# EasyEDA schematic SCH_璃奈的小板板_2021-11-10.json
TITLE: Sheet_1; REV: 1.0; Date: 2020-11-30; Sheet: 1/1; Drawn By: ZhaTi; Company: 黑联科技
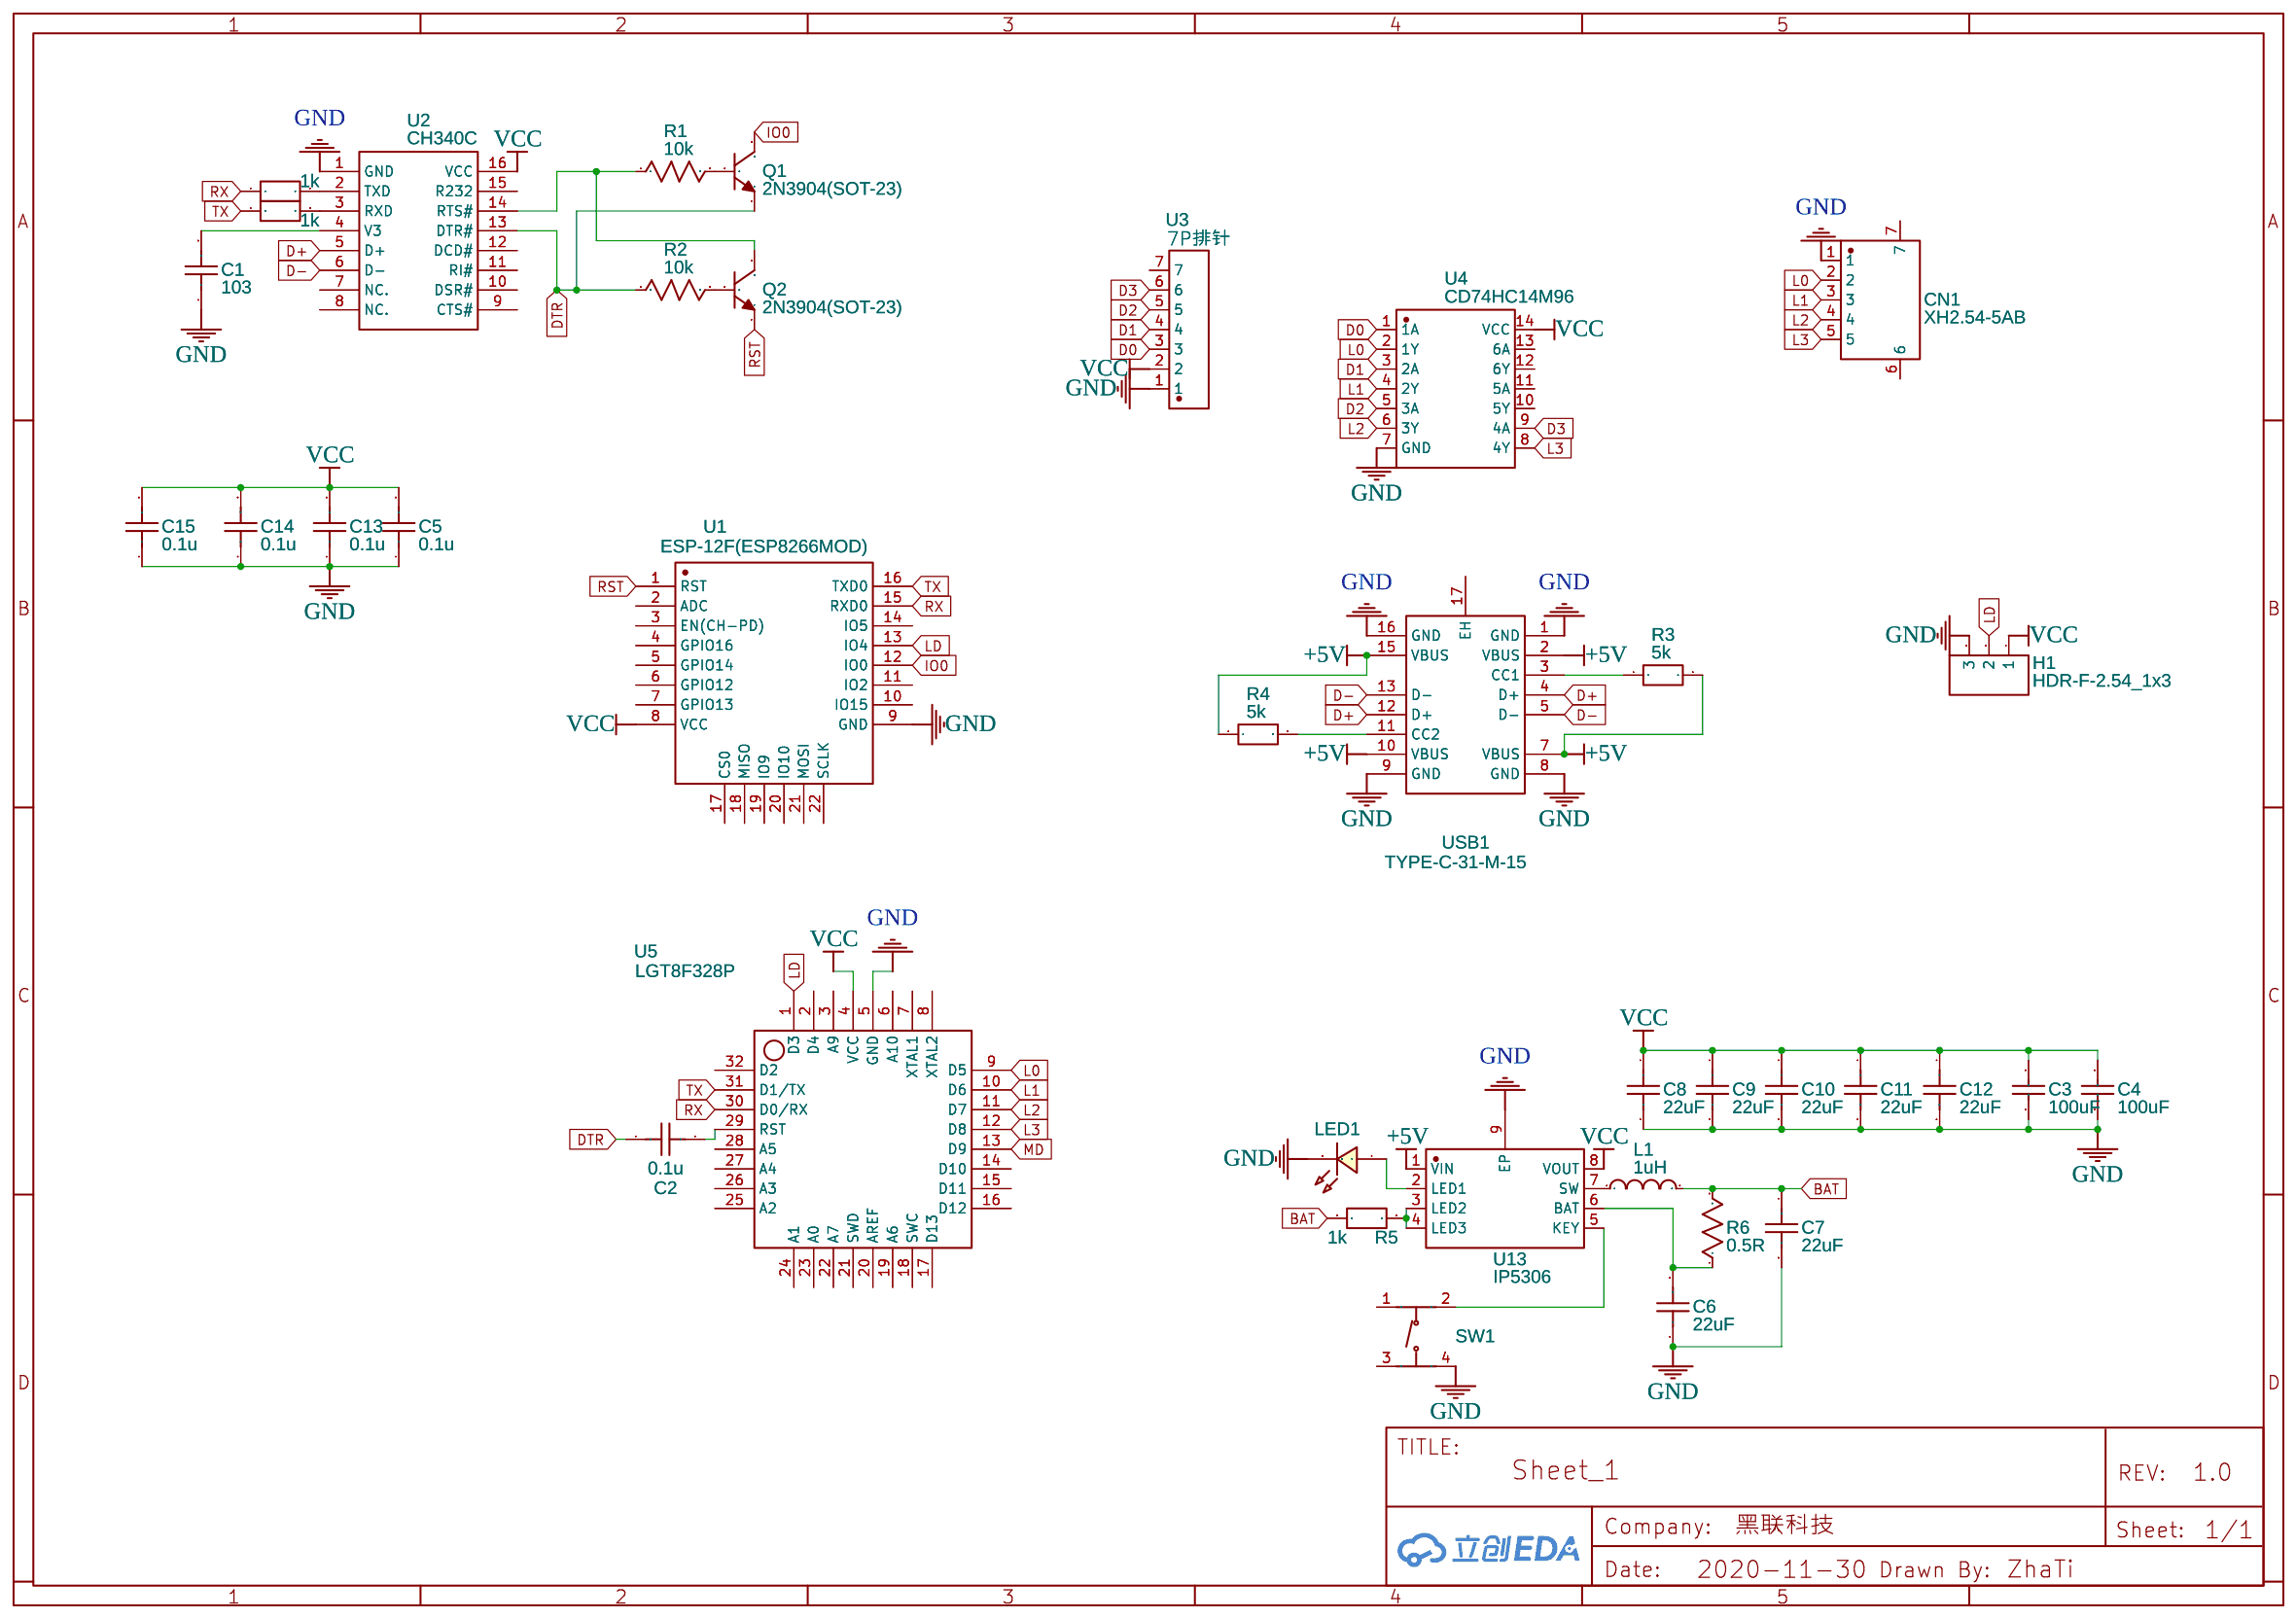
[diagram p0: schematic sheet]

## Parts
C1  103  [C0603]
C2  0.1u  [C0603]
C3  100uF  [C1210]
C4  100uF  [C1210]
C5  0.1u  [C0603]
C6  22uF  [C0805]
C7  22uF  [C0805]
C8  22uF  [C0805]
C9  22uF  [C0805]
C10  22uF  [C0805]
C11  22uF  [C0805]
C12  22uF  [C0805]
C13  0.1u  [C0603]
C14  0.1u  [C0603]
C15  0.1u  [C0603]
CN1  XH2.54-5AB  [CONN-SMD_5P-P2.54_XH2.54-5AB]
H1  HDR-F-2.54_1x3  [HDR-F-2.54_1X3]
L1  1uH  [IND-SMD_L7.1-W6.5-P5.60]
LED1  LED-0603_R  [LED0603_RED]
Q1  2N3904(SOT-23)  [SOT-23-3_L2.9-W1.3-P1.90-LS2.4-TR]
Q2  2N3904(SOT-23)  [SOT-23-3_L2.9-W1.3-P1.90-LS2.4-TR]
R1  10k  [R0603]
R2  10k  [R0603]
R3  5k  [R0603]
R4  5k  [R0603]
R5  1k  [R0603]
R6  0.5R  [R0603]
R7  1k  [R0603]
R8  1k  [R0603]
SW1  TS-1187A-B-A-B  [SW-SMD_4P-L5.1-W5.1-P3.70-LS6.5-TL-2]
U1  ESP-12F(ESP8266MOD)  [WIFIM-SMD_ESP-12F-ESP8266MOD]
U2  CH340C  [SOP-16_L10.0-W3.9-P1.27-LS6.0-BL]
U3  7P排针  [7P]
U4  CD74HC14M96  [SOIC-14_L8.7-W3.9-P1.27-LS6.0-BL]
U5  LGT8F328P  [QFP-32_L7.0-W7.0-P0.80-LS9.0-BL]
U13  IP5306  [ESOP-8_L4.9-W3.9-P1.27-LS6.0-BL-EP]
USB1  TYPE-C-31-M-15  [USBC-TH_TYPE-C-31-M-15]

## Library data of the parts
C1 C2 C5 C13-C15 = C_0603_US: Contributor: LCEDA_Lib
C3 C4 = 1210B472K251NT: Supplier: LCSC; Manufacturer: FH; Supplier Part: C52019
C6-C12 = CL21A226MQQNNNE: Supplier: LCSC; Manufacturer: SAMSUNG; Supplier Part: C5674
CN1 = XH2.54-5AB: Supplier: LCSC; Supplier Part: C146128; Manufacturer: Boom Precision Elec; Contributor: LCSC; JLCPCB Part Class: Extended Part
H1 = HDR-F-2.54_1x3: Supplier Part: C146690; Supplier: LCSC; Contributor: LCEDA_Lib
L1 = SPM6530T-1R0M120: Supplier: LCSC; Manufacturer: TDK; Supplier Part: C87572
LED1 = LED-0603_R: Manufacturer: EVERLIGHT(台湾亿光); Manufacturer Part: 19-217/R6C-AL1M2VY/3T; Supplier Part: C72044; Supplier: LCSC; Contributor: LCEDA_01
Q1 Q2 = 2N3904(SOT-23): Supplier: LCSC; Manufacturer: KEC; Manufacturer Part: 2n3904S-RTK/PS; Supplier Part: C18536; SMT Type: SOT-23; Contributor: LCEDA_Lib
R1 R2 R6 = R_0603_US: Contributor: LCEDA_Lib
R3-R5 R7 R8 = R_0603_EU: Contributor: LCEDA_Lib
SW1 = TS-1187A-B-A-B: Supplier: LCSC; Supplier Part: C318884; Manufacturer: XKB Enterprise; Contributor: LCSC; JLCPCB Part Class: Extended Part
U1 = ESP-12F(ESP8266MOD): Supplier: LCSC; Manufacturer: Ai-Thinker; Supplier Part: C82891
U2 = CH340C: Supplier: LCSC; Manufacturer: WCH; Supplier Part: C84681; LCSC Assembly: Yes; SMT Type: Extend
U3 = 7P: Contributor: ZJMAD
U4 = CD74HC14M96: Supplier: LCSC; Supplier Part: C74640; Manufacturer: Texas Instruments; Contributor: LCSC; JLCPCB Part Class: Extended Part
U5 = LGT8F328P: Contributor: ZhaTi
U13 = IP5306: Supplier: LCSC; Supplier Part: C181692; Manufacturer: INJOINIC; Contributor: LCSC; LCSC Assembly: Yes; SMT Type: Extend
USB1 = TYPE-C-31-M-15: Supplier: LCSC; Supplier Part: C223908; Manufacturer: Korean Hroparts Elec; Contributor: LCSC; JLCPCB Part Class: Extended Part

## Nets
+5V: R3.2 R4.1 U13.1(VIN) USB1.2(VBUS) USB1.7(VBUS) USB1.10(VBUS) USB1.15(VBUS)
GND: C1.1 C3.1 C4.1 C5.1 C6.1 C7.2 C8.2 C9.2 C10.2 C11.2 C12.2 C13.1 C14.1 C15.1 CN1.1 H1.3 LED1.2 SW1.4(D) U1.9(GND) U2.1(GND) U3.1 U4.7(GND) U5.5(GND) U13.9(EP) USB1.1(GND) USB1.8(GND) USB1.9(GND) USB1.16(GND)
VCC: C3.2 C4.2 C5.2 C8.1 C9.1 C10.1 C11.1 C12.1 C13.2 C14.2 C15.2 H1.1 U1.8(VCC) U2.16(VCC) U3.2 U4.14(VCC) U5.4(VCC) U13.8(VOUT)
BAT: C7.1 L1.2 R5.1 R6.2
D0: U3.3 U4.1(1A)
D1: U3.4 U4.3(2A)
D2: U3.5 U4.5(3A)
D3: U3.6 U4.9(4A)
D+: U2.5(D+) USB1.4(D+) USB1.12(D+)
D-: U2.6(D-) USB1.5(D-) USB1.13(D-)
DTR: C2.1 Q1.1(E) R2.1 U2.13(DTR#)
IO0: Q1.3(C) U1.12(IO0)
L0: CN1.2 U4.2(1Y) U5.9(D5)
L1: CN1.3 U4.4(2Y) U5.10(D6)
L2: CN1.4 U4.6(3Y) U5.11(D7)
L3: CN1.5 U4.8(4Y) U5.12(D8)
LD: H1.2 U1.13(IO4) U5.1(D3)
MD: U5.13(D9)
RST: Q2.1(E) U1.1(RST)
RX: R7.1 U1.15(RXD0) U5.30(D0/RX)
TX: R8.1 U1.16(TXD0) U5.31(D1/TX)
Net-(C1-2): C1.2 U2.4(V3)
Net-(C2-2): C2.2 U5.29(RST)
Net-(C6-2): C6.2 R6.1 U13.6(BAT)
Net-(L1-1): L1.1 U13.7(SW)
Net-(LED1-1): LED1.1 U13.2(LED1)
Net-(Q1-2): Q1.2(B) R1.2
Net-(Q2-2): Q2.2(B) R2.2
Net-(Q2-3): Q2.3(C) R1.1 U2.14(RTS#)
Net-(R3-1): R3.1 USB1.3(CC1)
Net-(R4-2): R4.2 USB1.11(CC2)
Net-(R5-2): R5.2 U13.3(LED2) U13.4(LED3)
Net-(R7-2): R7.2 U2.2(TXD)
Net-(R8-2): R8.2 U2.3(RXD)
Net-(SW1-2): SW1.2(B) U13.5(KEY)

Not connected (* = marked no-connect by the designer): CN1 6 7; SW1 1(A) 3(C); U1 2(ADC) 3(EN(CH-PD)) 4(GPIO16) 5(GPIO14) 6(GPIO12) 7(GPIO13) 10(IO15) 11(IO2) 14(IO5) 17(CS0) 18(MISO) 19(IO9) 20(IO10) 21(MOSI) 22(SCLK); U2 7(NC.) 8(NC.) 9(CTS#) 10(DSR#) 11(RI#) 12(DCD#) 15(R232); U3 7; U4 10(5Y) 11(5A) 12(6Y) 13(6A); U5 2(D4) 3(A9) 6(A10) 7(XTAL1) 8(XTAL2) 14(D10) 15(D11) 16(D12) 17(D13) 18(SWC) 19(A6) 20(AREF) 21(SWD) 22(A7) 23(A0) 24(A1) 25(A2) 26(A3) 27(A4) 28(A5) 32(D2); USB1 17(EH)
